# EAGLE design wqm (EAGLE 9.6.2)

## Sheet 1 of 2: Main-system
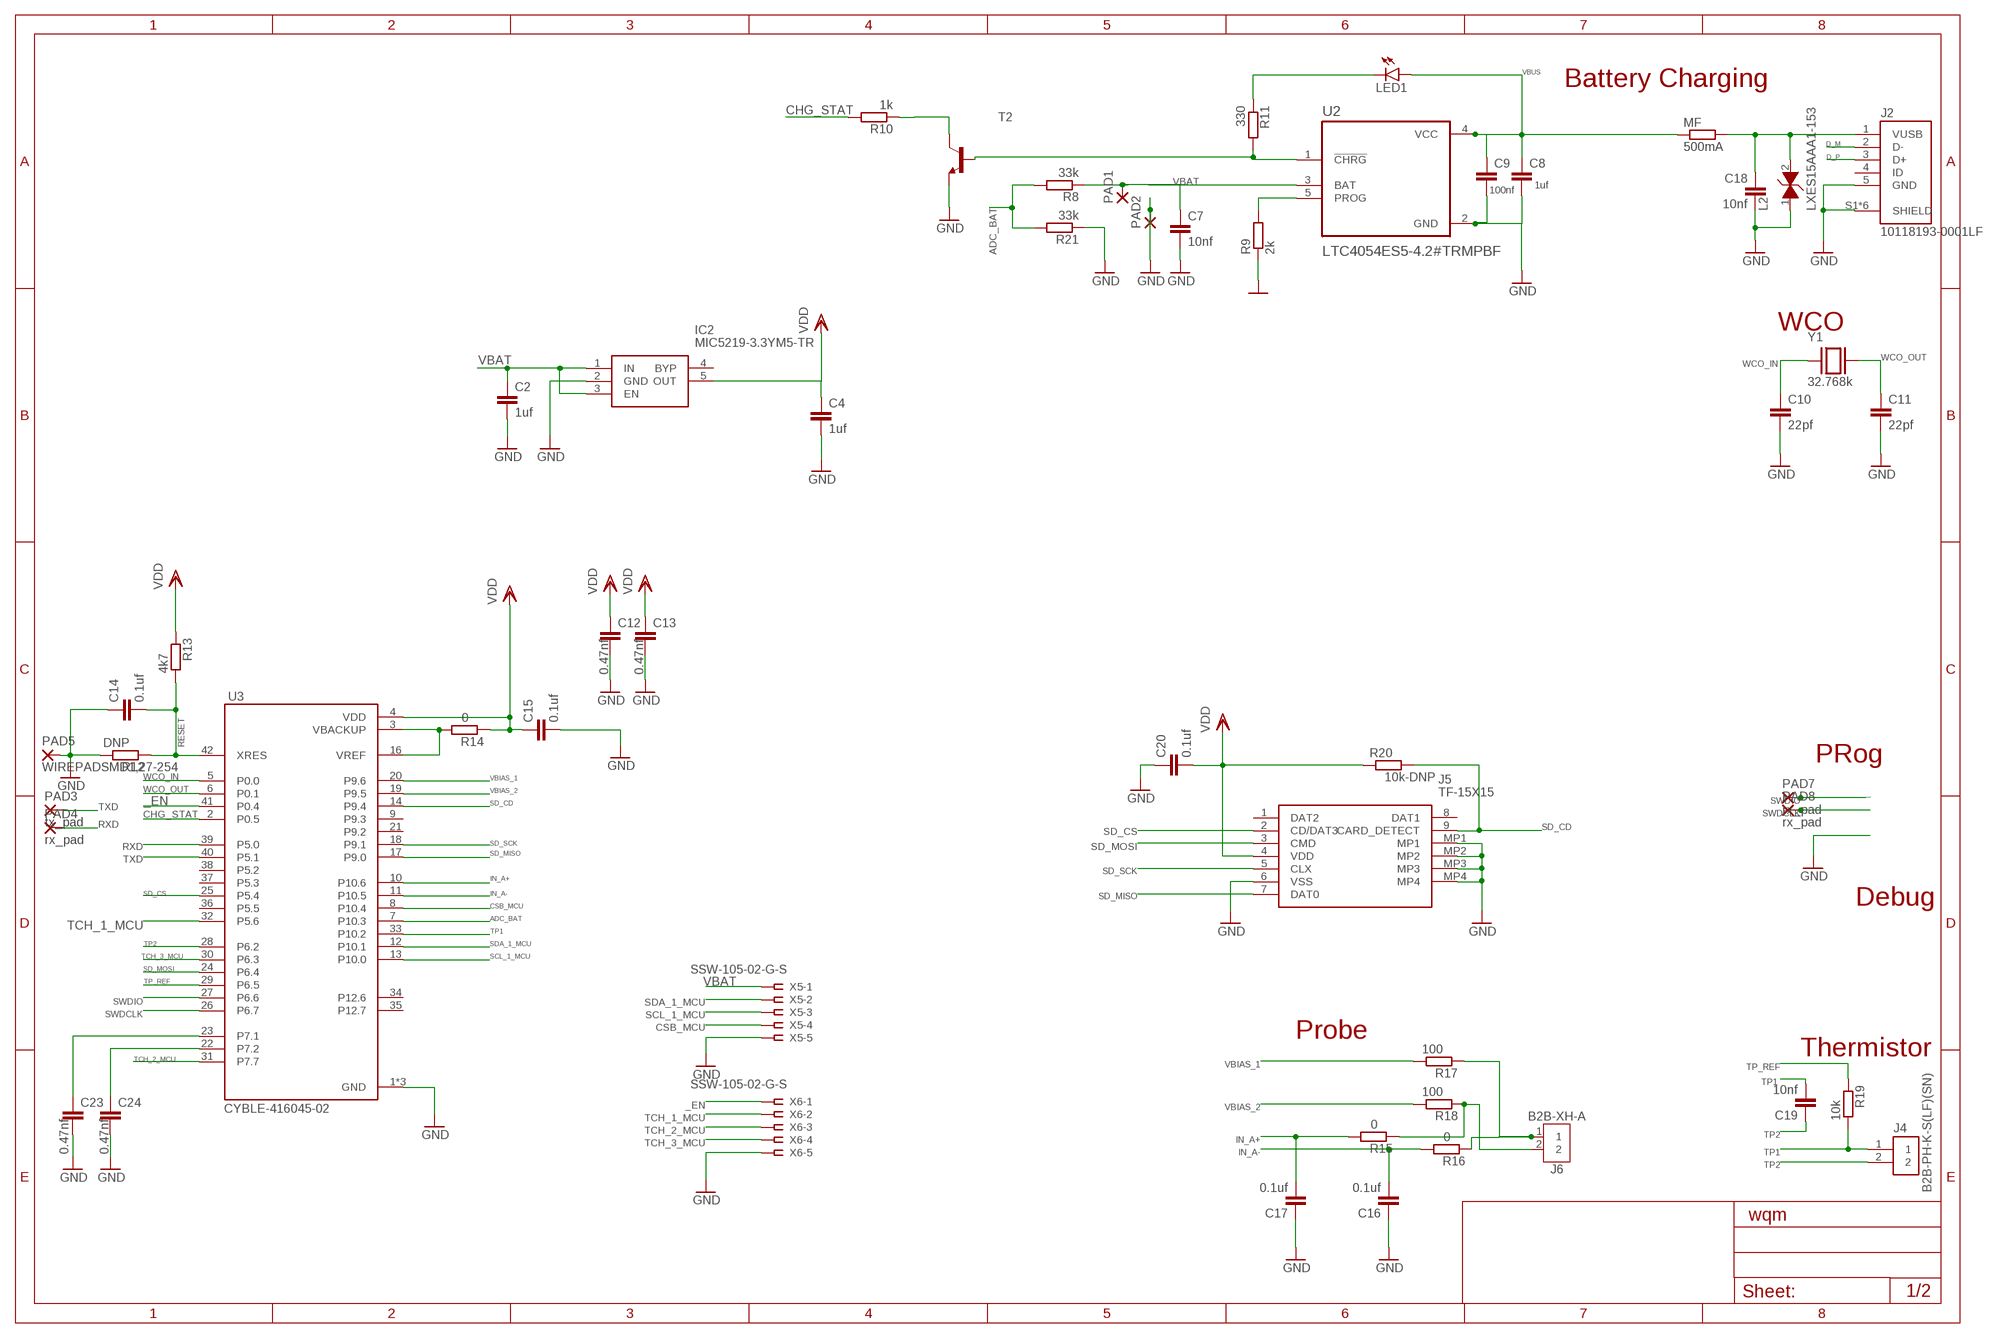
[diagram p0: schematic, sheet 1]

### Parts
C2  1uf  C-EUC0603K  [C0603K]
C4  1uf  C-EUC0603K  [C0603K]
C7  10nf  C-EUC0603K  [C0603K]
C8  1uf  C-EUC0603K  [C0603K]
C9  100nf  C-EUC0603K  [C0603K]
C10  22pf  C-EUC0402K  [C0402K]
C11  22pf  C-EUC0402K  [C0402K]
C12  0.47nf  C-EUC0402K  [C0402K]
C13  0.47nf  C-EUC0402K  [C0402K]
C14  0.1uf  C-EUC0402K  [C0402K]
C15  0.1uf  C-EUC0603K  [C0603K]
C16  0.1uf  C-EUC0603K  [C0603K]
C17  0.1uf  C-EUC0603K  [C0603K]
C18  10nf  C-EUC0402K  [C0402K]
C19  10nf  C-EUC0402K  [C0402K]
C20  0.1uf  C-EUC0603K  [C0603K]
C23  0.47nf  C-EUC0402K  [C0402K]
C24  0.47nf  C-EUC0402K  [C0402K]
IC2  MIC5219-3.3YM5-TR  [SOT95P280X145-5N]
J2  10118193-0001LF  [AMPHENOL_10118193-0001LF]
J4  B2B-PH-K-S(LF)(SN)  [JST_B2B-PH-K-S(LF)(SN)]
J5  TF-15X15  [TF15X15]
J6  B2B-XH-A  [B2B-XH-A]
L2  LXES15AAA1-153  [INDC1005X45]
LED1  LEDSML0603  [SML0603]
MF  500mA  R-EU_R0805  [R0805]
PAD1  SMD2  [SMD1,27-2,54]
PAD2  SMD2  [SMD1,27-2,54]
PAD3  tx_pad  WIREPADSMD1,27-254  [SMD1,27-2,54]
PAD4  rx_pad  WIREPADSMD1,27-254  [SMD1,27-2,54]
PAD5  WIREPADSMD1,27-254  [SMD1,27-2,54]
PAD7  rx_pad  WIREPADSMD1,27-254  [SMD1,27-2,54]
PAD8  rx_pad  WIREPADSMD1,27-254  [SMD1,27-2,54]
R8  33k  R-EU_R0603  [R0603]
R9  2k  R-EU_R0603  [R0603]
R10  1k  R-EU_R0603  [R0603]
R11  330  R-EU_R0603  [R0603]
R12  DNP  R-EU_R0603  [R0603]
R13  4k7  R-EU_R0603  [R0603]
R14  0  R-EU_R0603  [R0603]
R15  0  R-EU_R0603  [R0603]
R16  0  R-EU_R0603  [R0603]
R17  100  R-EU_R0603  [R0603]
R18  100  R-EU_R0603  [R0603]
R19  10k  R-EU_R0603  [R0603]
R20  10k-DNP  R-EU_R0603  [R0603]
R21  33k  R-EU_R0603  [R0603]
T2  MMBT4401LT1-NPN-SOT23-BEC  [SOT23-BEC]
U2  LTC4054ES5-4.2#TRMPBF  [SOT95P280X100-5N]
U3  CYBLE-416045-02  [XCVR_CYBLE-416045-02]
X5  SSW-105-02-G-S  [SSW-105-02-G-S]
X6  SSW-105-02-G-S  [SSW-105-02-G-S]
Y1  32.768k  MS3V-T1R  [XTAL_MS3V-T1R]

### Nets
_EN: U3.41(P0.4) X6.1
ADC_BAT: R8.2 R21.2 U3.7(P10.3)
CHG_STAT: R10.2 U3.2(P0.5)
CSB_MCU: U3.8(P10.4) X5.4
D_M: J2.2(D-)
D_P: J2.3(D+)
GND: C2.2 C4.2 C7.2 C8.2 C9.2 C10.2 C11.2 C12.2 C13.2 C14.1 C15.2 C16.1 C17.1 C18.2 C20.1 C23.2 C24.2 IC2.2(GND) J2.5(GND) J2.S1(SHIELD) J2.S2(SHIELD) J2.S3(SHIELD) J2.S4(SHIELD) J2.S5(SHIELD) J2.S6(SHIELD) J5.6(VSS) J5.MP1 J5.MP2 J5.MP3 J5.MP4 L2.1 PAD2.1(P) PAD5.1(P) R9.1 R12.2 R21.1 T2.E U2.2(GND) U3.1(GND) U3.15(GND) U3.43(GND) X5.5 X6.5
IN_A+: C17.2 R15.2 U3.10(P10.6)
IN_A-: C16.2 R16.2 U3.11(P10.5)
N$5: C24.1 U3.22(P7.2)
N$11: C18.1 J2.1(VUSB) L2.2 MF.2
N$15: R9.2 U2.5(PROG)
N$16: R10.1 T2.C
N$17: R11.2 T2.B U2.1(!CHRG)
N$18: LED1.C R11.1
N$19: R14.2 U3.3(VBACKUP) U3.16(VREF)
N$22: J6.1 R16.1 R17.1
N$23: J6.2 R15.1 R18.1
N$24: C23.1 U3.23(P7.1)
RESET: C14.2 R12.1 R13.2 U3.42(XRES)
RXD: PAD4.1(P) U3.39(P5.0)
SCL_1_MCU: U3.13(P10.0) X5.3
SD_CD: J5.9(CARD_DETECT) R20.2 U3.14(P9.4)
SD_CS: J5.2(CD/DAT3) U3.25(P5.4)
SD_MISO: J5.7(DAT0) U3.17(P9.0)
SD_MOSI: J5.3(CMD) U3.24(P6.4)
SD_SCK: J5.5(CLX) U3.18(P9.1)
SDA_1_MCU: U3.12(P10.1) X5.2
SWDCLK: PAD8.1(P) U3.26(P6.7)
SWDIO: PAD7.1(P) U3.27(P6.6)
TCH_1_MCU: U3.32(P5.6) X6.2
TCH_2_MCU: U3.31(P7.7) X6.3
TCH_3_MCU: U3.30(P6.3) X6.4
TP1: C19.2 J4.1 R19.2 U3.33(P10.2)
TP2: C19.1 J4.2 U3.28(P6.2)
TP_REF: R19.1 U3.29(P6.5)
TXD: PAD3.1(P) U3.40(P5.1)
VBAT: C2.1 C7.1 IC2.1(IN) IC2.3(EN) PAD1.1(P) R8.1 U2.3(BAT) X5.1
VBIAS_1: R17.2 U3.20(P9.6)
VBIAS_2: R18.2 U3.19(P9.5)
VBUS: C8.1 C9.1 LED1.A MF.1 U2.4(VCC)
VDD: C4.1 C12.1 C13.1 C15.1 C20.2 IC2.5(OUT) J5.4(VDD) R13.1 R14.1 R20.1 U3.4(VDD)
WCO_IN: C10.1 U3.5(P0.0) Y1.1
WCO_OUT: C11.1 U3.6(P0.1) Y1.2
Unconnected: IC2.4(BYP) J2.4(ID) J5.1(DAT2) J5.8(DAT1) U3.9(P9.3) U3.21(P9.2) U3.34(P12.6) U3.35(P12.7) U3.36(P5.5) U3.37(P5.3) U3.38(P5.2)

### Notes on the sheet
- Battery Charging
- WCO
- PRog
- Debug
- Probe
- Thermistor

## Sheet 2 of 2: HMI and pressure sensor
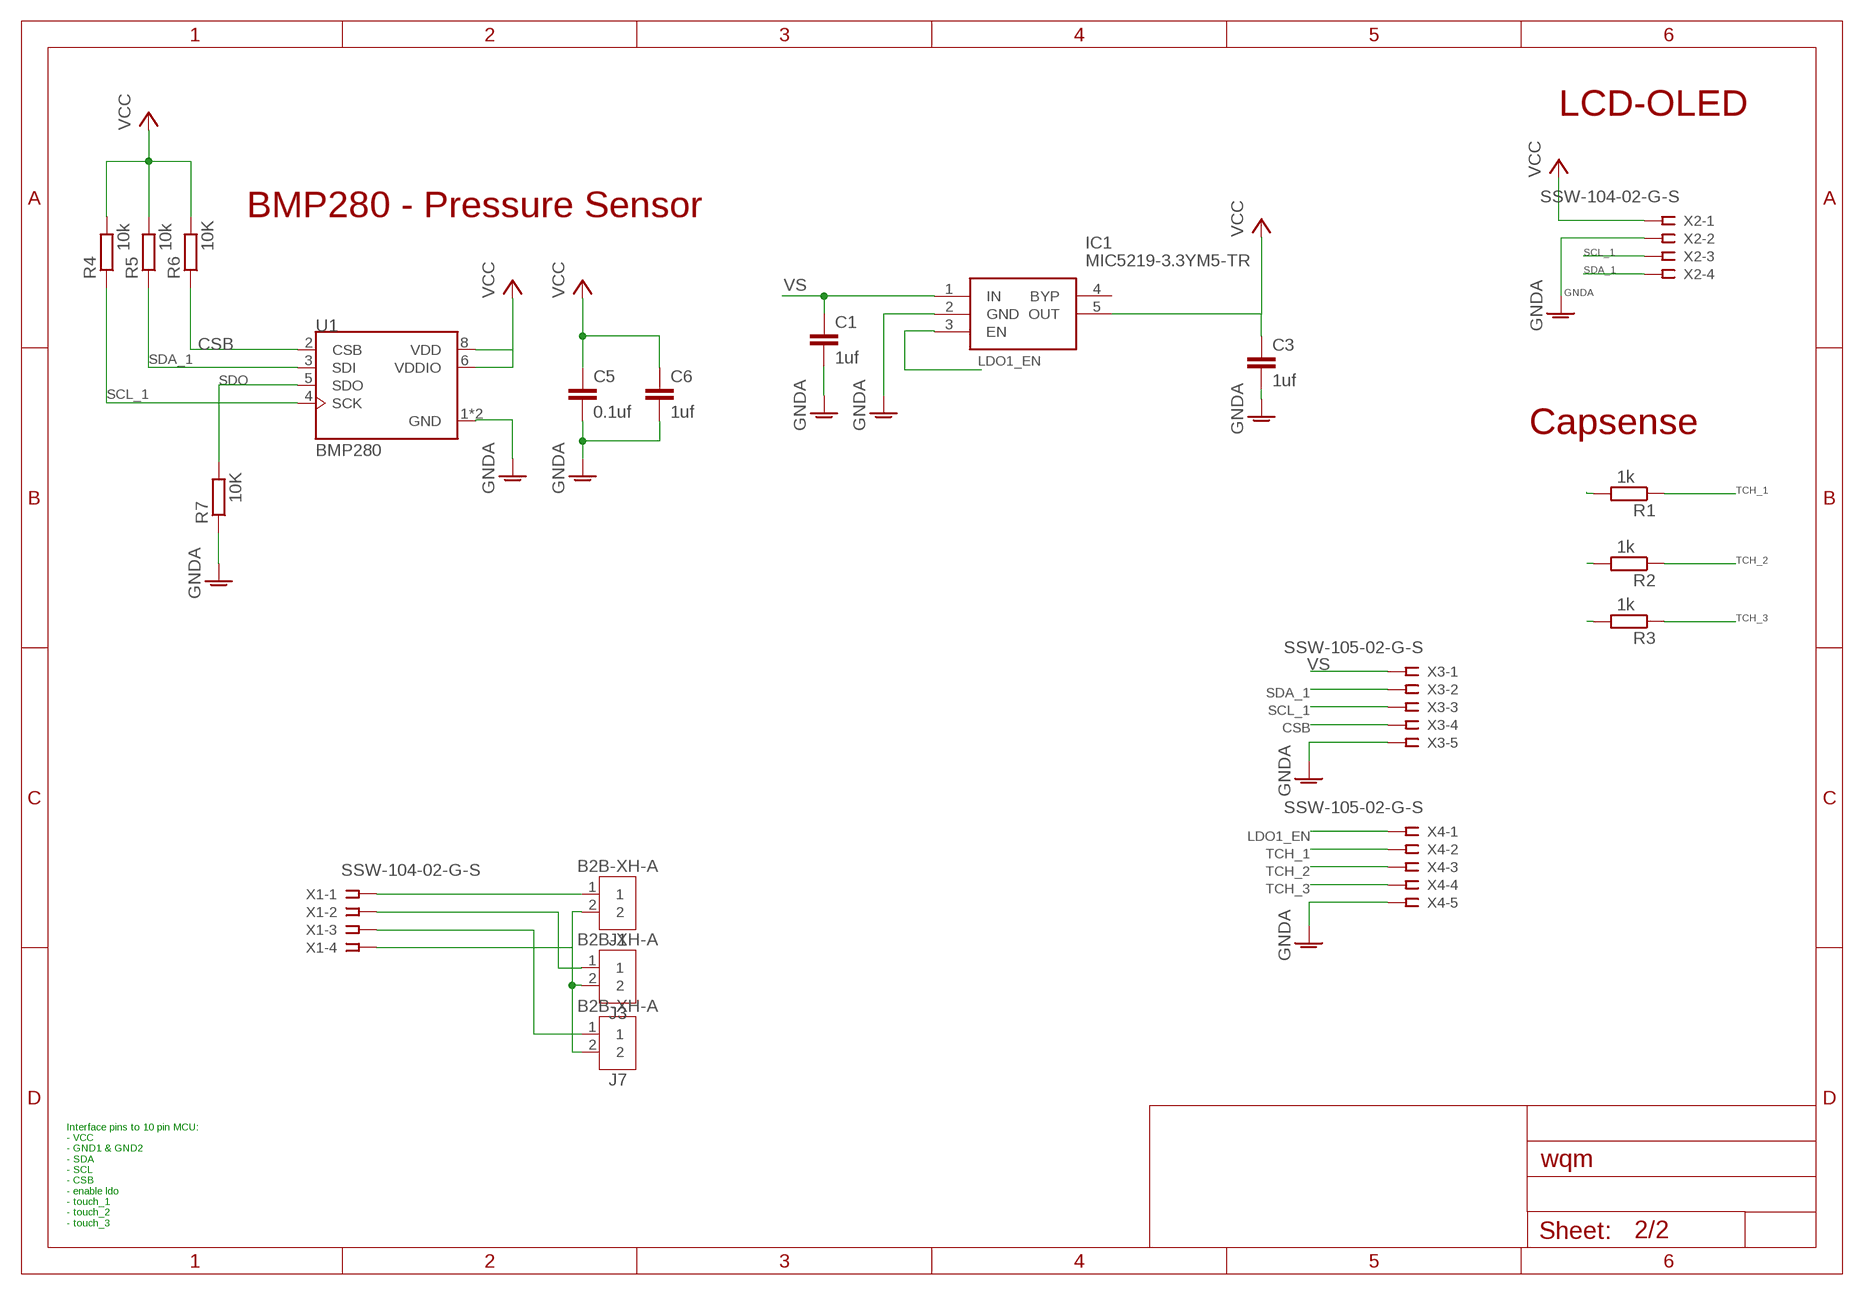
[diagram p1: schematic, sheet 2]

### Parts
C1  1uf  C-EUC0603K  [C0603K]
C3  1uf  C-EUC0603K  [C0603K]
C5  0.1uf  C-EUC0603K  [C0603K]
C6  1uf  C-EUC0603K  [C0603K]
IC1  MIC5219-3.3YM5-TR  [SOT95P280X145-5N]
J1  B2B-XH-A  [B2B-XH-A]
J3  B2B-XH-A  [B2B-XH-A]
J7  B2B-XH-A  [B2B-XH-A]
R1  1k  R-EU_R0603  [R0603]
R2  1k  R-EU_R0603  [R0603]
R3  1k  R-EU_R0603  [R0603]
R4  10k  R-EU_R0603  [R0603]
R5  10k  R-EU_R0603  [R0603]
R6  10K  R-EU_R0603  [R0603]
R7  10K  R-EU_R0603  [R0603]
U1  BMP280  [XDCR_BMP280]
X1  SSW-104-02-G-S  [SSW-104-02-G-S]
X2  SSW-104-02-G-S  [SSW-104-02-G-S]
X3  SSW-105-02-G-S  [SSW-105-02-G-S]
X4  SSW-105-02-G-S  [SSW-105-02-G-S]

### Nets
CSB: R6.1 U1.2(CSB) X3.4
GNDA: C1.2 C3.2 C5.2 C6.2 IC1.2(GND) R7.1 U1.1(GND) U1.7(GND) X2.2 X3.5 X4.5
LDO1_EN: IC1.3(EN) X4.1
N$1: R3.2
N$2: R2.2
N$3: R1.2
N$4: J1.1 X1.1
N$6: J3.1 X1.2
N$7: J7.1 X1.3
N$8: J1.2 J3.2 J7.2 X1.4
SCL_1: R4.1 U1.4(SCK) X2.3 X3.3
SDA_1: R5.1 U1.3(SDI) X2.4 X3.2
SDO: R7.2 U1.5(SDO)
TCH_1: R1.1 X4.2
TCH_2: R2.1 X4.3
TCH_3: R3.1 X4.4
VCC: C3.1 C5.1 C6.1 IC1.5(OUT) R4.2 R5.2 R6.2 U1.6(VDDIO) U1.8(VDD) X2.1
VS: C1.1 IC1.1(IN) X3.1
Unconnected: IC1.4(BYP)

### Notes on the sheet
- LCD-OLED
- BMP280 - Pressure Sensor
- Capsense
- Interface pins to 10 pin MCU: 
  - VCC 
  - GND1 & GND2
  - SDA
  - SCL
  - CSB
  - enable ldo
  - touch_1
  - touch_2
  - touch_3

## Library data of the parts
C1-C20 C23 C24 = rcl:C-EU: CAPACITOR, European symbol; SPICEPREFIX: C
IC1 IC2 = MIC5219-3.3YM5-TR:MIC5219-3.3YM5-TR: LDO Regulator Pos 3.3V 0.5A Microchip MIC5219-3.3YM5-TR, LDO Voltage Regulator, 500mA, 3.3 V +/-2%, 2.5 12 Vin, 5-Pin SOT-23 Source: Datasheet <http://www.microchip.com/mymicrochip/filehandler.aspx?ddocname=en579712>; ARROW_PART_NUMBER: MIC5219-3.3YM5-TR; ARROW_PRICE-STOCK: https://www.arrow.com/en/products/mic5219-3.3ym5-tr/microchip-technology?region=nac; DESCRIPTION: LDO Regulator Pos 3.3V 0.5A Microchip MIC5219-3.3YM5-TR, LDO Voltage Regulator, 500mA, 3.3 V +/-2%, 2.5 12 Vin, 5-Pin SOT-23; HEIGHT: 1.45mm; MANUFACTURER_NAME: Microchip; MANUFACTURER_PART_NUMBER: MIC5219-3.3YM5-TR; MOUSER_PART_NUMBER: 998-MIC5219-3.3YM5TR; MOUSER_PRICE-STOCK: https://www.mouser.co.uk/ProductDetail/Microchip-Technology/MIC5219-3.3YM5-TR?qs=U6T8BxXiZAWojkIJMtSJlw%3D%3D
J1 J3 J6 J7 = B2B-XH-A:B2B-XH-A: XH Connector Top Entry - 2POS Details see: Datasheet <http://www.jst-mfg.com/product/pdf/eng/eXH.pdf> Check availability <https://pricing.snapeda.com/parts/B2B-XH-A/JST%20Sales/view-part?ref=eda>; AVAILABILITY: In Stock; CHECK_PRICES: https://www.snapeda.com/parts/B2B-XH-A/JST+Sales+America+Inc./view-part/?ref=eda; DESCRIPTION: Connector Header Through Hole 2 position 0.098 (2.50mm); MF: JST Sales; MP: B2B-XH-A; PACKAGE: None; PRICE: None; PURCHASE-URL: https://www.snapeda.com/api/url_track_click_mouser/?unipart_id=552747&manufacturer=JST Sales&part_name=B2B-XH-A&search_term=jst 2p 2.50mm; SNAPEDA_LINK: https://www.snapeda.com/parts/B2B-XH-A/JST+Sales+America+Inc./view-part/?ref=snap
J2 = micro_usb_10118193-0001LF:10118193-0001LF: Check availability <https://pricing.snapeda.com/parts/10118193-0001LF/Amphenol/view-part?ref=eda>; AVAILABILITY: In Stock; CHECK_PRICES: https://www.snapeda.com/parts/10118193-0001LF/LC/view-part/?ref=eda; DESCRIPTION: Right Angle Surface Mount Mount Female USB Connector 100 V ac 1.8A | Amphenol FCI (Amphenol CS) 10118193-0001LF; MF: Amphenol; MP: 10118193-0001LF; PACKAGE: None; PRICE: None; PURCHASE-URL: https://www.snapeda.com/api/url_track_click_mouser/?unipart_id=12287595&manufacturer=Amphenol&part_name=10118193-0001LF&search_term=micro usb; SNAPEDA_LINK: https://www.snapeda.com/parts/10118193-0001LF/LC/view-part/?ref=snap
J4 = B2B-PH-K-S_LF__SN_:B2B-PH-K-S(LF)(SN): PH Series 2 Position 2 mm Pitch Through Hole Top Entry Shrouded Header Check availability <https://pricing.snapeda.com/parts/B2B-PH-K-S%28LF%29%28SN%29/JST%20Sales/view-part?ref=eda>; AVAILABILITY: In Stock; CHECK_PRICES: https://www.snapeda.com/parts/B2B-PH-K-S(LF)(SN)/JST+Sales+America+Inc./view-part/?ref=eda; DESCRIPTION: Connector Header Through Hole 2 position 0.079 (2.00mm); MF: JST Sales; MP: B2B-PH-K-S(LF)(SN); PACKAGE: None; PRICE: None; SNAPEDA_LINK: https://www.snapeda.com/parts/B2B-PH-K-S(LF)(SN)/JST+Sales+America+Inc./view-part/?ref=snap
J5 = TF-15X15:TF-15X15: Micro-SD Card Socket Source: Datasheet <https://datasheet.lcsc.com/szlcsc/SOFNG-TF-15-15_C111196.pdf>; DESCRIPTION: Micro-SD Card Socket; HEIGHT: 1.85mm; MANUFACTURER_NAME: SOFNG; MANUFACTURER_PART_NUMBER: TF-15X15
L2 = LXES15AAA1-153:LXES15AAA1-153: TVS DIODE 4VWM 0402 Check availability <https://pricing.snapeda.com/parts/LXES15AAA1-153/Murata/view-part?ref=eda>; AVAILABILITY: In Stock; CHECK_PRICES: https://www.snapeda.com/parts/LXES15AAA1-153/Murata+Electronics+North+America/view-part/?ref=eda; DESCRIPTION: - Clamp - Ipp Tvs Diode Surface Mount 1005; MF: Murata; MP: LXES15AAA1-153; PACKAGE: 0402 Murata; PRICE: None; PURCHASE-URL: https://www.snapeda.com/api/url_track_click_mouser/?unipart_id=653473&manufacturer=Murata&part_name=LXES15AAA1-153&search_term=tvs 0402; SNAPEDA_LINK: https://www.snapeda.com/parts/LXES15AAA1-153/Murata+Electronics+North+America/view-part/?ref=snap
LED1 = led:LED: LED OSRAM: - CHIPLED LG R971, LG N971, LY N971, LG Q971, LY Q971, LO R971, LY R971 LH N974, LH R974 LS Q976, LO Q976, LY Q976 LO Q996 - Hyper CHIPLED LW Q18S LB Q993, LB Q99A, LB R99A - SideLED LS A670, LO A670, LY A670, LG A670, LP A670 LB A673, LV A673, LT A673, LW A673 LH A674 LY A675 LS A676, LA A676, LO A676, LY A676, LW A676 LS A679, LY A679, LG A679 - Hyper Micro SIDELED® LS Y876, LA Y876, LO Y876, LY Y876 LT Y87S - SmartLED LW L88C, LW L88S LB L89C, LB L89S, LG L890 LS L89K, LO L89K, LY L89K LS L896, LA L896, LO L896, LY L896 - TOPLED LS T670, LO T670, LY T670, LG T670, LP T670 LSG T670, LSP T670, LSY T670, LOP T670, LYG T670 LG T671, LOG T671, LSG T671 LB T673, LV T673, LT T673, LW T673 LH T674 LS T676, LA T676, LO T676, LY T676, LB T676, LH T676, LSB T676, LW T676 LB T67C, LV T67C, LT T67C, LS T67K, LO T67K, LY T67K, LW E67C LS E67B, LA E67B, LO E67B, LY E67B, LB E67C, LV E67C, LT E67C LW T67C LS T679, LY T679, LG T679 LS T770, LO T770, LY T770, LG T770, LP T770 LB T773, LV T773, LT T773, LW T773 LH T774 LS E675, LA E675, LY E675, LS T675 LS T776, LA T776, LO T776, LY T776, LB T776 LHGB T686 LT T68C, LB T68C - Hyper Mini TOPLED® LB M676 - Mini TOPLED Santana® LG M470 LS M47K, LO M47K, LY M47K Source: http://www.osram.convergy.de LUXEON: - LUMILED® LXK2-PW12-R00, LXK2-PW12-S00, LXK2-PW14-U00, LXK2-PW14-V00 LXK2-PM12-R00, LXK2-PM12-S00, LXK2-PM14-U00 LXK2-PE12-Q00, LXK2-PE12-R00, LXK2-PE12-S00, LXK2-PE14-T00, LXK2-PE14-U00 LXK2-PB12-K00, LXK2-PB12-L00, LXK2-PB12-M00, LXK2-PB14-N00, LXK2-PB14-P00, LXK2-PB14-Q00 LXK2-PR12-L00, LXK2-PR12-M00, LXK2-PR14-Q00, LXK2-PR14-R00 LXK2-PD12-Q00, LXK2-PD12-R00, LXK2-PD12-S00 LXK2-PH12-R00, LXK2-PH12-S00 LXK2-PL12-P00, LXK2-PL12-Q00, LXK2-PL12-R00 Source: www.luxeon.com KINGBRIGHT: KA-3528ASYC Source: www.kingbright.com
MF R1-R21 = rcl:R-EU_: RESISTOR, European symbol; SPICEPREFIX: R
PAD1 PAD2 = wirepad:SMD2: SMD PAD
PAD3-PAD5 PAD7 PAD8 = wirepad:WIREPAD: Wire PAD connect wire on PCB
T2 = transistor:*-NPN-: NPN Transistror BF959 corrected 2008.03.06
U1 = BMP280:BMP280: BMP280 Absolute Barometric Pressure Sensor for Battery Powered Devices 2 x 2.5mm Check availability <https://pricing.snapeda.com/parts/BMP280/Bosch/view-part?ref=eda>; AVAILABILITY: In Stock; CHECK_PRICES: https://www.snapeda.com/parts/BMP280/Bosch+Sensortec/view-part/?ref=eda; DESCRIPTION: Pressure Sensor 4.35PSI ~ 15.95PSI (30kPa ~ 110kPa) Absolute - 16b 8-SMD; MF: Bosch; MP: BMP280; PACKAGE: SMD-8 Bosch Sensortec; PRICE: None; PURCHASE-URL: https://www.snapeda.com/api/url_track_click_mouser/?unipart_id=1186631&manufacturer=Bosch&part_name=BMP280&search_term=bmp280; SNAPEDA_LINK: https://www.snapeda.com/parts/BMP280/Bosch+Sensortec/view-part/?ref=snap
U2 = LTC4054ES5-4.2_TRMPBF:LTC4054ES5-4.2#TRMPBF: LTC4054-4.2 - Standalone Linear Li-Ion Battery Charger with Thermal Regulation in ThinSOT Check availability <https://pricing.snapeda.com/parts/LTC4054ES5-4.2%23TRMPBF/Analog%20Devices/view-part?ref=eda>; AVAILABILITY: In Stock; CHECK_PRICES: https://www.snapeda.com/parts/LTC4054ES5-4.2%23TRMPBF/Analog+Devices/view-part/?ref=eda; DESCRIPTION: Standalone Linear Li-Ion Battery Charger with Thermal Regulation in ThinSOT; MF: Analog Devices; MP: LTC4054ES5-4.2#TRMPBF; PACKAGE: SOT-5 Analog Devices; PRICE: None; PURCHASE-URL: https://www.snapeda.com/api/url_track_click_mouser/?unipart_id=4332981&manufacturer=Analog Devices&part_name=LTC4054ES5-4.2#TRMPBF&search_term=ltc4054; SNAPEDA_LINK: https://www.snapeda.com/parts/LTC4054ES5-4.2%23TRMPBF/Analog+Devices/view-part/?ref=snap
U3 = CYBLE-416045-02:CYBLE-416045-02: CYBLE-416045-02 Check availability <https://pricing.snapeda.com/parts/CYBLE-416045-02/Cypress%20Semiconductor/view-part?ref=eda>; AVAILABILITY: Not in stock; CHECK_PRICES: https://www.snapeda.com/parts/CYBLE-416045-02/Cypress+semiconductor/view-part/?ref=eda; DESCRIPTION: Bluetooth Bluetooth v5.0 Transceiver Module 2.4GHz ~ 2.5GHz Integrated, Trace Surface Mount; MF: Cypress Semiconductor; MP: CYBLE-416045-02; PACKAGE: None; PRICE: None; SNAPEDA_LINK: https://www.snapeda.com/parts/CYBLE-416045-02/Cypress+semiconductor/view-part/?ref=snap
X1 X2 = con-samtec:SSW-104-02-G-S: THROUGH-HOLE .025" SQ POST SOCKET Source: Samtec SSW.pdf; MF: Samtec Inc.; MPN: SSW-104-02-G-S; OC_FARNELL: unknown; OC_NEWARK: 11P9384
X3-X6 = con-samtec:SSW-105-02-G-S: THROUGH-HOLE .025" SQ POST SOCKET Source: Samtec SSW.pdf; MF: Samtec Inc.; MPN: SSW-105-02-G-S; OC_FARNELL: unknown; OC_NEWARK: 11P9399
Y1 = MS3V-T1R:MS3V-T1R: Tuning Fork Crystal 30-200 kHz in 1.4 x 1.4 x 6.7 package Check availability <https://pricing.snapeda.com/parts/MS3V-T1R/Micro%20Crystal/view-part?ref=eda>; AVAILABILITY: Not in stock; CHECK_PRICES: https://www.snapeda.com/parts/MS3V-T1R/Micro+Crystal/view-part/?ref=eda; DESCRIPTION: Tuning Fork Crystal 30-200 kHz in 1.4 x 1.4 x 6.7 package; MF: Micro Crystal; MP: MS3V-T1R; PACKAGE: SMD-3 Micro Crystal; PRICE: None; SNAPEDA_LINK: https://www.snapeda.com/parts/MS3V-T1R/Micro+Crystal/view-part/?ref=snap

## Board
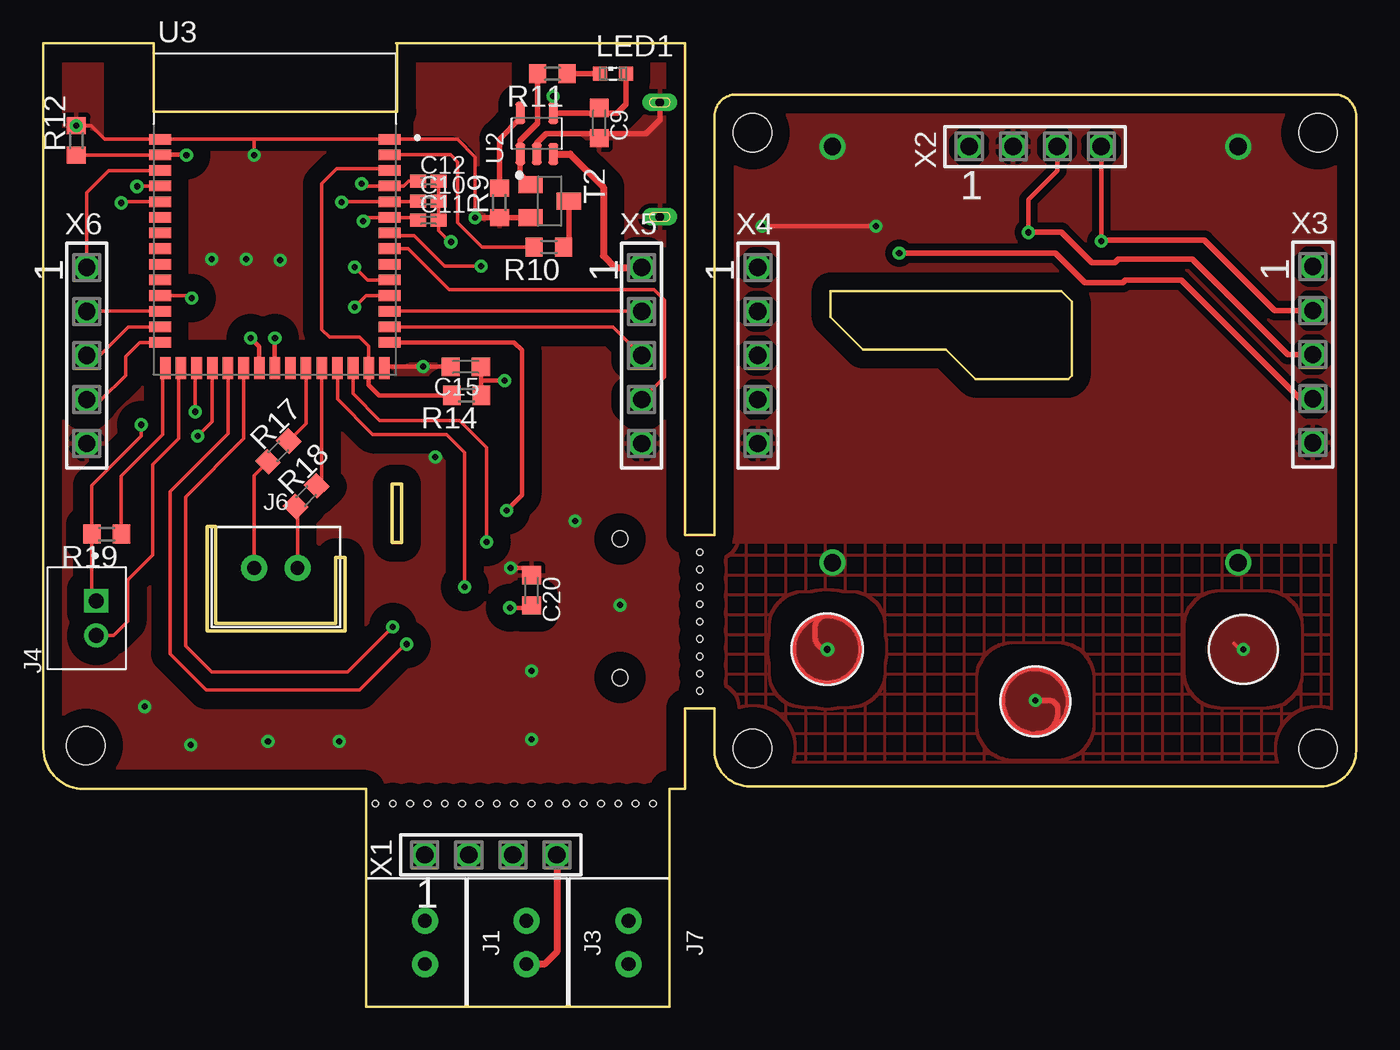
[diagram p2: board, top side]
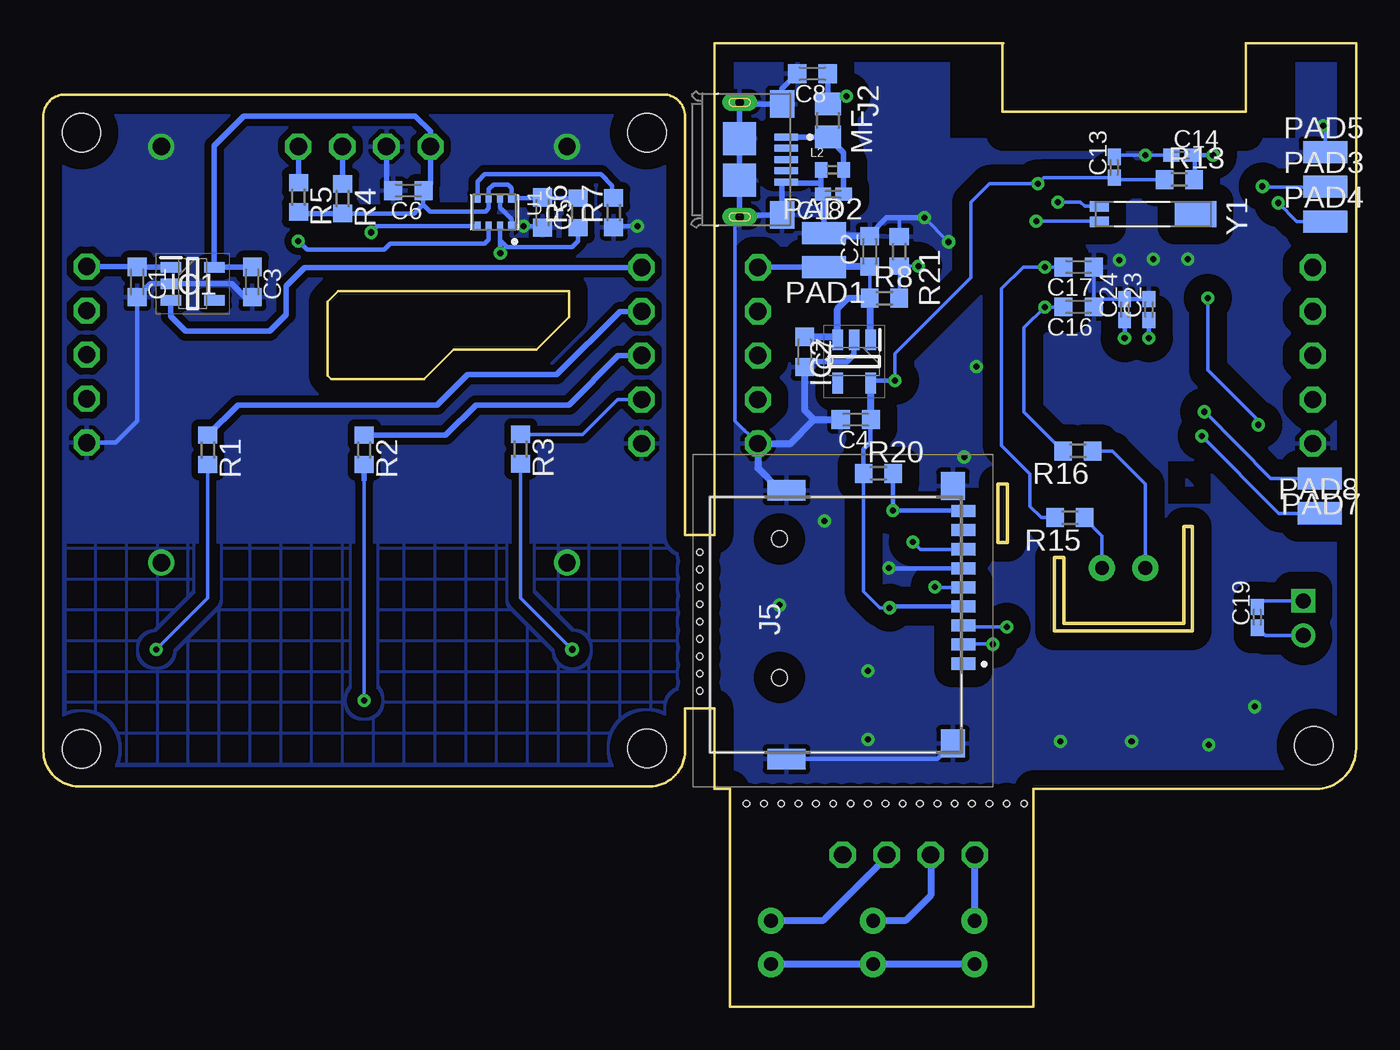
[diagram p3: board, bottom side, seen from below]

Size 75.7 x 55.55 mm. Coordinates in mm from the lower left corner, seen from the top.
Outline: 20.35,55.55 37,55.55 37,27.2 38.7,27.2 38.7,51.35 arc-90 39.95,52.6 74.45,52.6 arc-90 75.7,51.35 75.7,14.75 arc-90 73.65,12.7 40.75,12.7 arc-90 38.7,14.75 38.7,17.2 37,17.2 37,12.55 36.1,12.55 36.1,0 18.6,0 18.6,12.55 2.35,12.55 arc-90 0,14.9 0,15.05 0,55.55 6.35,55.55 6.35,51.6 20.4,51.6 20.4,55.55
Outline: 45.4,41.25 58.7,41.25 59.3,40.65 59.3,36.4 59.1,36.2 53.75,36.2 52.05,37.9 47.25,37.9 45.4,39.75 45.4,41.25
Outline: 9.45,21.65 9.45,27.7 9.95,27.7 9.95,22.1 16.85,22.1 16.85,25.9 17.4,25.9 17.4,21.65 9.45,21.65
Outline: 20.1,26.75 20.1,30.15 20.65,30.15 20.65,26.75 20.1,26.75
Copper layers (1*16): Top 0.035mm / dielectric 1.5mm / Bottom 0.035mm
Design rules "default": minimum track width 6mil, minimum drill 0.35mm, track to track 6mil, track to pad 6mil, pad to pad 6mil, via to via 6mil, smd to smd 6mil, copper to edge 40mil, drill to drill 6mil, minimum pad ring 10mil, minimum via ring 8mil, stop-mask expansion 4mil, vias tented up to drill 0mil, thermal gap 10mil
Holes 2.2 mm at 40.9,14.9 73.5,14.85 40.9,50.4 73.5,50.4 2.45,15.05
Holes 0.35 mm at 37.85,18.2 37.85,19.2 37.85,20.2 37.85,21.2 37.85,22.2 37.85,23.2 37.85,24.2 37.85,25.2 37.85,26.2 35.15,11.7 34.15,11.7 33.15,11.7 32.15,11.7 31.15,11.7 30.15,11.7 29.15,11.7 28.15,11.7 27.15,11.7 26.15,11.7 25.15,11.7 24.15,11.7 23.15,11.7 22.15,11.7 21.15,11.7 20.15,11.7 19.15,11.7

### Footprints (pad centres in the part's own frame; a part is rotated, then mirrored left to right if it is on the bottom)
C0603K = smd 1.05 x 1.08: 1 -0.875,0; 2 0.875,0
C0402K = smd 0.925 x 0.74: 1 -0.6,0; 2 0.6,0
SOT95P280X145-5N = smd 1.2 x 0.6: 1 -1.25,0.95; 2 -1.25,0; 3 -1.25,-0.95; 4 1.25,-0.95; 5 1.25,0.95
B2B-XH-A = drill 0.8 pad 1.5: 1 0,0; 2 2.5,0
AMPHENOL_10118193-0001LF = smd 0.4 x 1.35: 1 -1.3,2.675; 2 -0.65,2.675; 3 0,2.675; 4 0.65,2.675; 5 1.3,2.675 | smd 1.6 x 1.4: S1 -3.2,2.45; S2 3.2,2.45 | smd 1.9 x 1.9: S3 1.2,0; S4 -1.2,0 | drill 0.5 pad 0.9 long: S5 -3.3,0; S6 3.3,0
JST_B2B-PH-K-S(LF)(SN) = drill 0.86 square: 1 1,-0.55 | drill 0.86: 2 -1,-0.55
TF15X15 = smd 0.7 x 1.4: 1 2.475,6.95; 2 1.375,6.95; 3 0.275,6.95; 4 -0.825,6.95; 5 -1.925,6.95; 6 -3.025,6.95; 7 -4.125,6.95; 8 -5.225,6.95; 9 -6.325,6.95 | smd 1.6 x 1.4: MP1 -7.775,6.35; MP2 7.075,6.35 | smd 1.2 x 2.2: MP3 -7.525,-3.25; MP4 7.975,-3.25 | hole 0.9: -4.725,-3.65; 3.275,-3.65
INDC1005X45 = smd 0.7 x 0.9: 1 -0.65,0; 2 0.65,0
SML0603 = smd 0.8 x 0.8: A 0.75,0; C -0.75,0
R0805 = smd 1.3 x 1.5: 1 -0.95,0; 2 0.95,0
SMD1,27-2,54 = smd 1.27 x 2.54: 1 0,0
R0603 = smd 1 x 1.1: 1 -0.85,0; 2 0.85,0
SOT23-BEC = smd 1 x 1.4: B -0.95,-1.1; C 0,1.1; E 0.95,-1.1
XDCR_BMP280 = smd 0.5 x 0.35: 1 0.8,0.975; 2 0.8,0.325; 3 0.8,-0.325; 4 0.8,-0.975; 5 -0.8,-0.975; 6 -0.8,-0.325; 7 -0.8,0.325; 8 -0.8,0.975
SOT95P280X100-5N = smd 1.26 x 0.55: 1 -1.185,0.95; 2 -1.185,0; 3 -1.185,-0.95; 4 1.185,-0.95; 5 1.185,0.95
XCVR_CYBLE-416045-02 = smd 1.27 x 0.61: 1 6.62,4.32; 2 6.62,3.42; 3 6.62,2.52; 4 6.62,1.62; 5 6.62,0.71; 6 6.62,-0.19; 7 6.62,-1.09; 8 6.62,-1.99; 9 6.62,-2.89; 10 6.62,-3.79; 11 6.62,-4.7; 12 6.62,-5.6; 13 6.62,-6.5; 14 6.62,-7.4; 30 -6.62,-7.4; 31 -6.62,-6.5; 32 -6.62,-5.6; 33 -6.62,-4.7; 34 -6.62,-3.79; 35 -6.62,-2.89; 36 -6.62,-1.99; 37 -6.62,-1.09; 38 -6.62,-0.19; 39 -6.62,0.71; 40 -6.62,1.62; 41 -6.62,2.52; 42 -6.62,3.42; 43 -6.62,4.32 | smd 0.61 x 1.27: 15 6.31,-8.87; 16 5.41,-8.87; 17 4.51,-8.87; 18 3.61,-8.87; 19 2.71,-8.87; 20 1.8,-8.87; 21 0.9,-8.87; 22 0,-8.87; 23 -0.9,-8.87; 24 -1.8,-8.87; 25 -2.7,-8.87; 26 -3.61,-8.87; 27 -4.51,-8.87; 28 -5.41,-8.87; 29 -6.31,-8.87
SSW-104-02-G-S = drill 1 pad 1.5 octagon: 1 -3.81,0; 2 -1.27,0; 3 1.27,0; 4 3.81,0
SSW-105-02-G-S = drill 1 pad 1.5 octagon: 1 -5.08,0; 2 -2.54,0; 3 0,0; 4 2.54,0; 5 5.08,0
XTAL_MS3V-T1R = smd 0.6 x 1.1: 1 -0.45,-3.1; 2 0.45,-3.1 | smd 1.5 x 2.4: S1 0,2.45

### Placement (x,y rotation side)
C1  70.29,41.79 270 bottom
C2  28.05,43.55 90 bottom
C3  63.65,41.79 270 bottom
C4  28.85,33.85 180 bottom
C5  46.91,45.79 270 bottom
C6  54.65,47.06 180 bottom
C7  31.8,37.75 270 bottom
C8  31.35,53.8 180 bottom
C9  32.05,50.95 270 top
C10  22.2,46.45 0 top
C11  22.2,45.35 0 top
C12  22.2,47.6 0 top
C13  13.95,48.4 90 bottom
C14  10.05,49.1 0 bottom
C15  24.35,36.9 180 top
C16  16,40.35 180 bottom
C17  16,42.65 180 bottom
C18  30.15,46.85 180 bottom
C19  5.7,22.45 90 bottom
C20  28.15,24 270 top
C23  11.95,40.2 90 bottom
C24  13.35,40.2 90 bottom
IC1  67.09,41.69 0 bottom
IC2  28.95,37.2 270 bottom
J1  22,4.95 270 top
J2  35.55,48.85 270 bottom
J3  27.85,4.95 270 top
J4  2.5,22.4 90 top
J5  29.6,22.25 270 bottom
J6  12.15,25.3 0 top
J7  33.75,4.95 270 top
L2  30.2,48.25 0 bottom
LED1  32.85,53.8 0 top
MF  30.45,51.1 270 bottom
PAD1  30.7,42.65 90 bottom
PAD2  30.7,44.6 270 bottom
PAD3  1.79,47.27 270 bottom
PAD4  1.79,45.27 270 bottom
PAD5  1.79,49.27 270 bottom
PAD7  2.1,30.45 90 bottom
PAD8  2.1,28.45 270 bottom
R1  66.22,32.11 270 bottom
R2  57.2,32.11 270 bottom
R3  48.18,32.16 270 bottom
R4  58.44,46.59 270 bottom
R5  60.99,46.67 270 bottom
R6  44.86,45.77 90 bottom
R7  42.81,45.79 90 bottom
R8  27.2,40.85 0 bottom
R9  26.3,46.35 90 top
R10  29.15,43.8 180 top
R11  29.35,53.8 180 top
R12  1.9,49.95 90 top
R13  10.2,47.7 0 bottom
R14  24.4,35.25 180 top
R15  16.5,28.2 180 bottom
R16  16.05,32.05 180 bottom
R17  13.55,32.02 45 top
R18  15.15,29.44 45 top
R19  3.65,27.25 180 top
R20  27.55,30.75 0 bottom
R21  26.35,43.55 270 bottom
T2  29.2,46.45 270 top
U1  49.69,45.81 270 bottom
U2  28.45,50.35 90 top
U3  13.35,45.7 0 top
X1  25.8,8.75 0 top
X2  57.19,49.6 0 top
X3  73.2,37.6 270 top
X4  41.2,37.55 270 top
X5  34.5,37.55 270 top
X6  2.5,37.55 270 top
Y1  11.7,45.7 270 bottom

### Tracks (layer width: path | path; a pad name or v marks a point on that pad's centre or on a via)
_EN
  Top 0.2: X6.1 2.5,46.95 3.77,48.22 U3.41
ADC_BAT  (via drill 0.35)
  Top 0.2: U3.7 20.12,44.46 21.39,44.46 23.15,42.7 v25.25,42.7
  Bottom 0.2: R8.2 R21.2 v25.25,42.7
CHG_STAT
  Top 0.2: U3.2 23.48,49.12 23.9,48.7 23.9,45.2 25.3,43.8 R10.2
CSB  (via drill 0.35)
  Top 0.305: X3.4 72.45,35.06 65.61,41.9 62.4,41.9 62.25,41.75 60.05,41.75 58.35,43.45 v49.35,43.45
  Bottom 0.254: R6.1 44.86,44.14 45.2,43.8 48.95,43.8 49.37,44.22 U1.2 49.35,44.99 v49.35,43.45
CSB_MCU
  Top 0.203: U3.8 21.04,43.71 23.4,41.35 35.21,41.35 35.81,40.75 35.81,36.32 X5.4
GND  (via drill 0.35)
  Top 0.2: U3.1 23.88,50.02 24.9,49 v24.9,45.5 | C11.2 22.8,44.75 23.45,44.1 v23.5,44.1 | v12.15,49.1 12.15,50.02
  Top 0.203: U3.1 12.15,50.02 U3.43 3.53,50.02 2.75,50.8 R12.2 | C11.2 C10.2 C12.2
  Top 0.254: v26.95,25.3 27.73,25.3 C20.1 | U3.15 19.73,36.9 C15.2
  Top 0.305: U2.2 28.45,49.8 29,50.35 32.05,50.35 | J2.S5 35.55,51.15 34.75,50.35 32.05,50.35 | C9.2 32.05,50.35 | R9.1 T2.E v24.9,45.5
  Bottom 0.2: R21.1 26.35,45.5 | J2.S6 35.55,45.35 35.81,45.09 35.81,33.78 X5.5 | PAD5.1 1.79,50.69 R12.2 | v23.5,44.1 v24.9,45.5 | C14.1 v12.15,49.1 13.85,49.1 C13.2 | C16.1 15.12,40.65 | 15.12,40.65 C17.1 | C24.2 14.98,40.8 15.12,40.65
  Bottom 0.254: C24.2 C23.2 | J5.6 26.93,25.27 v26.95,25.3 | J5.MP2 24.15,14.28 J5.MP4
  Bottom 0.305: 30.85,47.5 30.85,46.85 C18.2 30.7,46.8 PAD2.1 | 30.85,47.5 L2.1 | 30.85,47.5 32.88,47.5 J2.5 33.1,47.55 J2.S2 35.55,45.65 J2.S6 J2.S3 J2.S4 J2.S5 35.45,52.05 J2.S1 33.1,52.92 C8.2 | v24.9,45.5 26.35,45.5 27.07,45.5 28.05,44.52 C2.2 | IC2.2 28.95,37.6 29.35,37.2 31.48,37.2 C7.2
  Bottom 0.406: C2.2 30.52,44.42 PAD2.1 | C7.2 31.8,34.4 31.25,33.85 | 31.25,33.85 C4.2 | 31.25,33.85 32.63,32.47 X5.5 34.5,31.05 33.23,29.77 J5.MP3
  other vias: 1.9,50.8 9.7,43.1 11.7,43.1 13.65,43.05 21.9,36.9 22.6,31.7 28.15,19.35 30.65,28 12.95,15.3 17.05,15.3 8.5,15.1 5.85,17.3 28.15,15.4 33.25,23.15
  pour Bottom (isolate 1, rank 6): 0,55.5 3.4,55.5 3.4,50 23.5,50 23.5,55.5 37,55.5 37,12.55 0,12.55
  pour Top (isolate 1, rank 6): 0,55.55 3.4,55.55 3.4,50 23.5,55.55 37,55.55 37,12.55 0,12.55
GNDA  (via drill 0.35, 1)
  Top 0.254: v48,45.01 v41.46,45.01 v41.45,45
  Bottom 0.254: C5.2 47.01,45.01 v48,45.01 U1.1 48.71,45.41 49.37,46.06 U1.7 | v41.45,45 42.75,45 R7.1 | C1.2 70.29,33.76 71.53,32.52 X3.5
  Bottom 0.305: C1.2 69.52,41.69 IC1.2 64.84,41.69 64.06,40.91 C3.2 | X2.2 55.92,47.45 C6.2
  other vias: 45.5,49.6 45.5,25.6 68.9,49.6 68.9,25.6
  pour Top (isolate 0.406): 38.7,52.6 75.7,52.6 75.7,26.75 38.7,26.75
  pour Top (isolate 1.25, rank 2, hatched): 38.7,26.75 38.7,12.85 75.7,12.85 75.7,26.75
  pour Bottom (isolate 0.406): 38.7,52.6 75.7,52.6 75.7,26.75 38.7,26.75
  pour Bottom (isolate 0.6, rank 2, hatched): 38.7,26.75 75.7,26.75 75.7,12.7 38.7,12.7
IN_A+  (via drill 0.35)
  Top 0.2: v17.95,42.65 18.69,41.91 U3.10
  Bottom 0.2: C17.2 v17.95,42.65 19.2,42.65 20.45,41.4 20.45,32.37 18.8,30.72 18.8,28.85 18.15,28.2 R15.2
IN_A-  (via drill 0.35)
  Top 0.2: U3.11 18.6,41 v17.95,40.35
  Bottom 0.2: C16.2 v17.95,40.35 19.15,39.15 19.15,34.3 R16.2
LDO1_EN
  Bottom 0.305: IC1.3 68.37,40.71 68.37,39.82 67.5,38.95 62.65,38.95 61.7,39.9 61.7,41.55 60.62,42.63 X4.1
N$1  (via drill 0.4)
  Top 0.305: v45.2,20.6 arc-90 44.5,21.3 44.5,21.9 arc-90 45.15,22.55 45.2,22.55 | 45.25,22.55 45.2,22.55 | 47.15,20.6 47.15,20.65 | 47.15,20.6 arc-90 45.2,18.65 arc-90 43.25,20.6 arc-90 45.2,22.55 | 45.2,22.55 arc-90 47.15,20.6
  Bottom 0.203: 45.22,20.6 48.18,23.56 R3.2
  Bottom 0.305: v45.2,20.6 45.22,20.6
  pour Top: 45.2,22.55 arc-90 47.15,20.6 arc-90 45.2,18.65 45.15,18.65 arc-90 43.25,20.55 43.25,20.6 arc-90
N$2  (via drill 0.35)
  Top 0.305: v57.2,17.65 58,17.65 arc-90 58.5,17.15 58.5,16.95 arc-90 57.25,15.7 arc-90 55.3,17.65 arc-90 57.15,19.5 arc-90 59.1,17.55 arc-90 57.3,15.75
  Bottom 0.203: 57.2,30.4 v57.2,17.65
  Bottom 0.305: R2.2 57.2,30.4
  pour Top: 57.2,19.5 arc-90 59.1,17.6 arc-90 57.2,15.7 57.15,15.7 arc-90 55.3,17.55 55.3,17.6 arc-90
N$3  (via drill 0.35)
  Top 0.2: v69.2,20.6 69,20.6 68.65,20.95
  Bottom 0.203: 69.18,20.6 66.22,23.56 R1.2
  Bottom 0.305: v69.2,20.6 69.18,20.6
  pour Top: 69.17,22.57 arc-90 71.17,20.57 arc-90 69.25,18.65 69.15,18.65 arc-90 67.2,20.6 arc-90
N$4
  Bottom 0.406: X1.1 J1.1
N$5  (via drill 0.35)
  Top 0.254: v13.35,38.55 U3.22
  Bottom 0.254: C24.1 v13.35,38.55
N$6
  Bottom 0.406: X1.2 24.53,6.42 26,4.95 J3.1
N$7
  Bottom 0.406: X1.3 27.07,8.63 30.75,4.95 J7.1
N$8
  Top 0.406: X1.4 29.61,3.16 28.9,2.45 J3.2
  Bottom 0.406: J1.2 J3.2 J7.2
N$11
  Bottom 0.305: C18.1 L2.2 29.55,49.25 MF.2 J2.1
N$15
  Top 0.305: U2.5 27.5,51.23 26.3,50.03 R9.2
N$16
  Top 0.305: T2.C 30.3,44.1 R10.1
N$17
  Top 0.305: R11.2 28.5,50.95 27.5,49.95 U2.1 27.5,48 T2.B
N$18
  Top 0.305: R11.1 LED1.C
N$19
  Top 0.2: 19.75,48.22 19.65,48.32 16.92,48.32 16.05,47.45 16.05,39.05 16.5,38.6 18.25,38.6 18.76,38.09 U3.16
  Top 0.254: U3.16 18.76,35.84 19.35,35.25 R14.2 | 19.75,48.22 U3.3
N$22
  Top 0.2: J6.1 12.15,30.62 R17.1
  Bottom 0.2: R16.1 14.05,32.05 12.15,30.15 J6.1
N$23
  Top 0.2: J6.2 14.65,28.74 R18.1
  Bottom 0.2: R15.1 15.65,28.15 14.65,27.15 J6.2
N$24  (via drill 0.35)
  Top 0.254: U3.23 12.45,38.05 v11.95,38.55
  Bottom 0.254: v11.95,38.55 C23.1
NONE
  pour Top (isolate 2.184, rank 2): 8.3,31.9 18.85,31.9 18.85,21.15 arc-90 18.1,20.4 8.3,20.4
  pour Bottom (isolate 2.184, rank 2): 18.85,31.9 18.85,20.4 8.3,20.4 8.3,31.9
RESET  (via drill 0.35)
  Top 0.203: U3.42 6.71,49.1 R12.1
  Top 0.254: U3.42 8.23,49.12 v8.25,49.1
  Bottom 0.254: R13.2 9.3,47.75 9.3,49.1 | v8.25,49.1 9.3,49.1 | 9.3,49.1 C14.2
RXD  (via drill 0.35)
  Top 0.2: v4.5,46.35 4.56,46.41 U3.39
  Bottom 0.2: v4.5,46.35 3.43,45.27 PAD4.1
SCL_1  (via drill 0.35)
  Top 0.254: v56.8,44.65 56.8,46.55 58.46,48.21 X2.3
  Top 0.305: X3.3 71.75,37.6 66.25,43.1 62,43.1 61.8,42.9 60.45,42.9 58.7,44.65 v56.8,44.65
  Bottom 0.254: U1.4 56.44,45.01 v56.8,44.65
  Bottom 0.305: R4.1 58.44,49.58 X2.3
SCL_1_MCU
  Top 0.2: U3.13 32.85,39.2 X5.3
SD_CD  (via drill 0.35)
  Top 0.254: U3.14 27.15,38.3 27.6,37.85 27.6,29.5 v26.7,28.6
  Bottom 0.254: J5.9 22.68,28.6 v26.7,28.6 R20.2
SD_CS  (via drill 0.35)
  Top 0.2: U3.25 10.65,33.05 7.3,29.7 7.3,20.35 9.4,18.25 18.25,18.25 20.9,20.9 v20.95,20.9
  Bottom 0.2: v20.95,20.9 22.63,20.9 J5.2
SD_MISO  (via drill 0.35)
  Top 0.2: U3.17 17.86,35.34 19.4,33.8 24,33.8 25.55,32.25 v25.55,26.8
  Bottom 0.2: v25.55,26.8 25.13,26.38 J5.7
SD_MOSI  (via drill 0.35)
  Top 0.2: U3.24 11.55,32.75 8.2,29.4 8.2,20.8 9.7,19.3 17.55,19.3 v20.15,21.9
  Bottom 0.2: v20.15,21.9 22.57,21.9 J5.3
SD_SCK  (via drill 0.35)
  Top 0.2: U3.18 16.96,35.04 19,33 23.25,33 24.3,31.95 v24.3,24.2
  Bottom 0.2: v24.3,24.2 24.27,24.18 J5.5
SDA_1  (via drill 0.35)
  Top 0.254: v61,44.15 61,44.2 X2.4
  Top 0.305: X3.2 71.01,40.14 66.95,44.2 61,44.2
  Bottom 0.254: U1.3 50.02,44.23 50.25,44 55.7,44 56.05,43.65 60.5,43.65 v61,44.15
  Bottom 0.305: R5.1 X2.4
SDA_1_MCU
  Top 0.2: U3.12 X5.2
SDO
  Bottom 0.254: U1.5 50.66,47.59 50.25,48 43.55,48 42.9,47.35 42.9,46.73 R7.2
SWDCLK  (via drill 0.35)
  Top 0.2: U3.26 9.74,33.74 v8.9,32.9
  Bottom 0.2: v8.9,32.9 4.45,28.45 PAD8.1
SWDIO  (via drill 0.35)
  Top 0.2: U3.27 8.75,36.74 v8.75,34.3
  Bottom 0.2: v8.75,34.3 8.7,34.3 4.91,30.45 PAD7.1
TCH_1
  Bottom 0.305: X4.2 42.46,40.09 46.1,36.45 51.25,36.45 53,34.7 64.48,34.7 R1.1
TCH_1_MCU
  Top 0.2: U3.32 X6.2
TCH_2
  Bottom 0.305: X4.3 42.55,37.55 45.4,34.7 50.76,34.7 52.5,32.96 R2.1
TCH_2_MCU
  Top 0.2: X6.3 3.25,37.55 4.9,39.2 U3.31
TCH_3
  Bottom 0.203: X4.4 42.59,35.01 44.6,33 R3.1
  Bottom 0.305: 41.2,35.03 X4.4 | R3.1
TCH_3_MCU
  Top 0.2: U3.30 5.55,38.3 4.75,37.5 4.75,36.4 3.35,35 X6.4
TP1  (via drill 0.35)
  Top 0.2: J4.1 2.8,23.65 R19.2 2.8,30.05 5.65,32.9 v5.65,33.55 | U3.33 8.4,41 v8.55,40.85
  Bottom 0.2: C19.2 5.35,23.4 J4.1 | v8.55,40.85 8.55,36.7 5.65,33.8 v5.65,33.55
TP2
  Top 0.2: U3.28 7.79,36.68 7.79,32.75 6.3,31.25 6.3,26.05 4.85,24.61 4.85,22.2 4.05,21.4 J4.2
  Bottom 0.2: C19.1 5.25,21.4 J4.2
TP_REF
  Top 0.2: U3.29 6.89,36.68 6.89,32.99 4.5,30.6 R19.1
TXD  (via drill 0.35)
  Top 0.2: U3.40 5.42,47.32 v5.4,47.3
  Bottom 0.2: v5.4,47.3 5.35,47.25 1.82,47.25 PAD3.1
VBAT
  Top 0.406: 29.4,48.9 U2.3 30.38,49.16 32.3,47.25 32.3,43.3 32.97,42.63 X5.1
  Bottom 0.2: C2.1 R8.1
  Bottom 0.305: PAD1.1 34.48,42.65 X5.1
  Bottom 0.406: C2.1 30.68,42.67 PAD1.1 | IC2.1 28,40.8 R8.1 29.3,40.85 29.9,40.25 IC2.3 30.07,38.62 C7.1
VBIAS_1
  Top 0.2: U3.20 15.15,33.62 R17.2
VBIAS_2
  Top 0.2: U3.19 16.06,30.34 R18.2
VBUS  (via drill 0.35)
  Top 0.305: LED1.A 33.6,52.05 33.09,51.53 32.05,51.53 | 32.05,51.53 U2.4 v29.4,52.5 | C9.1 32.05,51.53
  Bottom 0.305: MF.1 30.45,52.4 | 30.45,52.4 30.45,53.77 C8.1 | v29.4,52.5 30.35,52.5 30.45,52.4
VCC
  Bottom 0.254: 46.96,46.62 C5.1 | R6.2 46.96,46.62 | 46.96,46.62 46.96,46.61 U1.8 48.7,46.62 48.7,47.2 48.9,47.4 49.75,47.4 50.02,47.13 U1.6 50.02,46.03 50.2,45.85 53.4,45.85 53.8,46.25 | 53.8,46.25 53.8,47.03 C6.1 | R4.2 54.31,45.74 53.8,46.25
  Bottom 0.305: C3.1 63.68,42.64 IC1.5 65.84,49.66 64.15,51.35 54.25,51.35 53.38,50.48 X2.1 53.38,47.45 C6.1 | R5.2 60.91,45.74 R4.2
VDD  (via drill 0.35)
  Top 0.2: U3.4 18.48,47.32 v18.35,47.45
  Top 0.203: U3.4 20.77,47.32 21.05,47.6 C12.1
  Top 0.254: v26.9,23 28.02,23 C20.2 | C15.1 25.25,36.88 25.25,36.1 | 25.25,36.1 R14.1 | 25.25,36.1 v26.59,36.1
  Bottom 0.2: R20.1 28.4,23.95 27.45,23 v26.9,23 | R13.1 13.85,47.7 C13.1 18,47.8 v18.35,47.45 21.15,47.45 22.2,46.4 22.2,42.05 26.59,37.66 v26.59,36.1
  Bottom 0.254: R20.1 28.4,32.15 28,32.55 28,33.88 | J5.4 26.82,23.07 v26.9,23 | v26.59,36.1 27.85,36.1 IC2.5
  Bottom 0.406: IC2.5 28,33.88 C4.1
VS
  Bottom 0.305: 68.32,42.66 IC1.1 70.27,42.64 C1.1 70.31,42.68 X3.1
WCO_IN  (via drill 0.35)
  Top 0.203: C10.1 21.56,46.41 U3.5 v17.21,46.41 v17.2,46.4
  Bottom 0.203: v17.2,46.4 15.9,46.4 15.65,46.15 Y1.1
WCO_OUT  (via drill 0.35)
  Top 0.203: C11.1 21.44,45.51 U3.6 18.66,45.51 v18.45,45.3
  Bottom 0.203: v18.45,45.3 14.85,45.3 Y1.2